# Altium schematic sheet adc.SchDoc
size A4
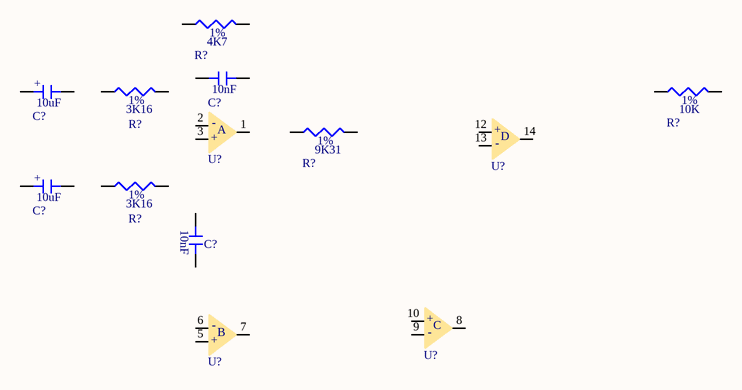
[diagram p0: adc.SchDoc]

## Parts
(Parts that share a designator on the sheet are numbered #1, #2 ... from top to bottom, then left to right.)
C?#1  Cap 10nF  (value not drawn)
C?#2  Cap 10uF  (value not drawn)
C?#3  Cap 10uF  (value not drawn)
C?#4  Cap 10nF  (value not drawn)
R?#1  R 4k7  (value not drawn)
R?#2  R 3k16  (value not drawn)
R?#3  R 10K  (value not drawn)
R?#4  R 9K31  (value not drawn)
R?#5  R 3k16  (value not drawn)
U?#1  TLV2474 (1)  (value not drawn)
U?#2  TLV2474 (4)  (value not drawn)
U?#3  TLV2474 (3)  (value not drawn)
U?#4  TLV2474 (2)  (value not drawn)

## Nets

Not connected (* = marked no-connect by the designer): C?#1 1 2; C?#2 1 2; C?#3 1 2; C?#4 1 2; R?#1 1 2; R?#2 1 2; R?#3 1 2; R?#4 1 2; R?#5 1 2; U?#1 1 2 3; U?#2 12 13 14; U?#3 8 9 10; U?#4 5 6 7

## Notes on the sheet
- (in symbol Cap 10nF) 10nF
- (in symbol Cap 10uF) +; 10uF
- (in symbol R 3k16) 1%; 3K16
- (in symbol R 4k7) 1%; 4K7
- (in symbol R 9K31) 1%; 9K31
- (in symbol R 10K) 1%; 10K
- (in symbol TLV2474 (1)) -; A; +
- (in symbol TLV2474 (2)) -; B; +
- (in symbol TLV2474 (3)) +; C; -
- (in symbol TLV2474 (4)) +; D; -